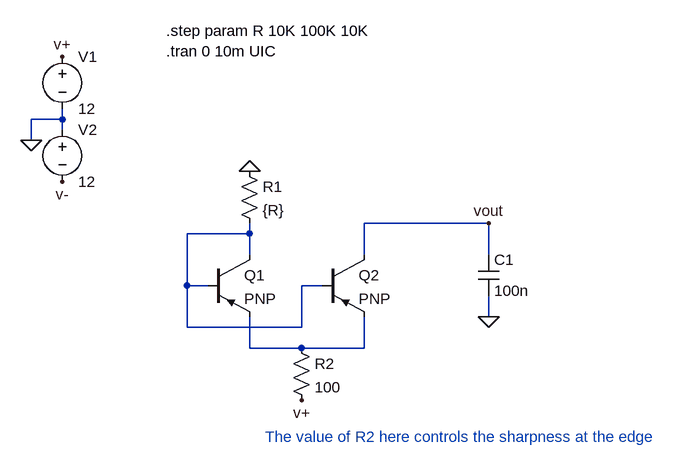
[diagram p0: schematic linear-charge.asc]
linear-charge.asc, the LTspice schematic file:
Version 4
SHEET 1 1012 884
WIRE 96 224 96 208
WIRE 96 224 48 224
WIRE 96 240 96 224
WIRE 48 256 48 224
WIRE 752 384 560 384
WIRE 384 400 384 384
WIRE 384 400 288 400
WIRE 384 432 384 400
WIRE 560 432 560 384
WIRE 752 432 752 384
WIRE 288 480 288 400
WIRE 320 480 288 480
WIRE 496 480 464 480
WIRE 752 528 752 496
WIRE 288 544 288 480
WIRE 464 544 464 480
WIRE 464 544 288 544
WIRE 384 576 384 528
WIRE 464 576 384 576
WIRE 560 576 560 528
WIRE 560 576 464 576
FLAG 48 256 0
FLAG 96 128 v+
FLAG 96 320 v-
FLAG 752 384 vout
FLAG 464 656 v+
FLAG 752 528 0
FLAG 384 304 0
SYMBOL cap 736 432 R0
SYMATTR InstName C1
SYMATTR Value 100n
SYMBOL voltage 96 112 R0
SYMATTR InstName V1
SYMATTR Value 12
SYMBOL voltage 96 224 R0
SYMATTR InstName V2
SYMATTR Value 12
SYMBOL res 368 288 R0
SYMATTR InstName R1
SYMATTR Value {R}
SYMBOL pnp 320 432 R0
SYMATTR InstName Q1
SYMBOL pnp 496 432 R0
SYMATTR InstName Q2
SYMBOL res 448 560 R0
SYMATTR InstName R2
SYMATTR Value 100
TEXT 256 88 Left 2 !.step param R 10K 100K 10K\n.tran 0 10m UIC
TEXT 408 712 Left 2 ;The value of R2 here controls the sharpness at the edge

The netlist it stands for:
* linear-charge.asc
C1 vout 0 100n
V1 v+ 0 12
V2 0 v- 12
R1 0 N001 {R}
Q1 N001 N001 N002 0 PNP
Q2 vout N001 N002 0 PNP
R2 N002 v+ 100
.model NPN NPN
.model PNP PNP
.lib standard.bjt
.step param R 10K 100K 10K
.tran 0 10m UIC
* The value of R2 here controls the sharpness at the edge
.backanno
.end